# EAGLE schematic Project 2 (EAGLE 6.5.1)
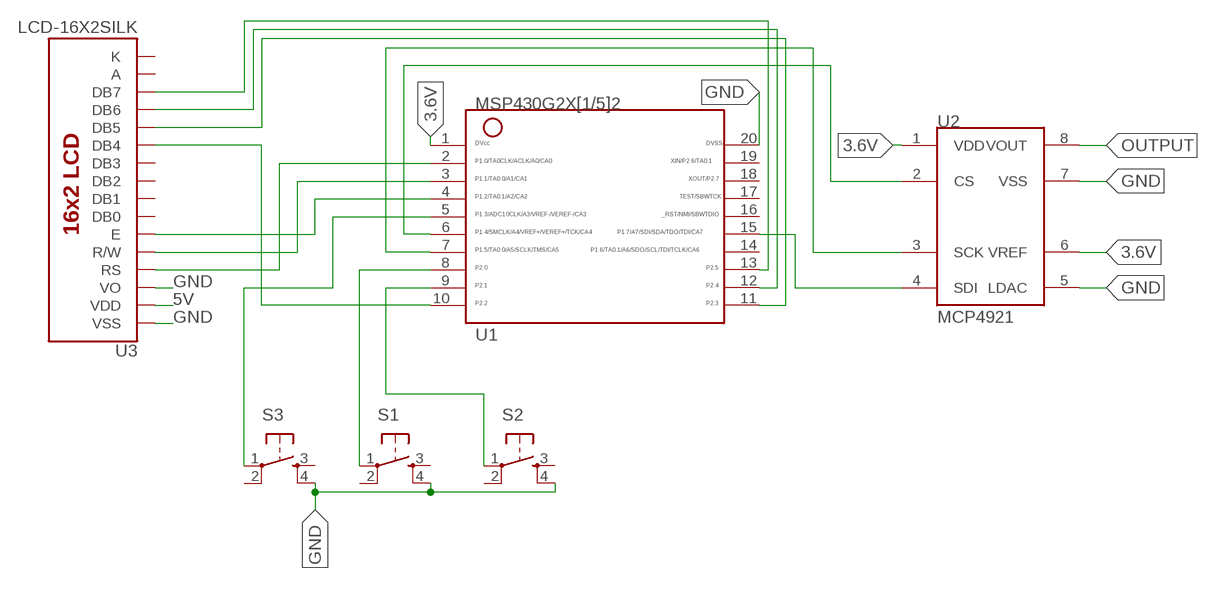
[diagram p0: schematic, sheet 1]

## Parts
S1  TAC_SWITCHPTH  [TACTILE-PTH]
S2  TAC_SWITCHPTH  [TACTILE-PTH]
S3  TAC_SWITCHPTH  [TACTILE-PTH]
U1  G2X[1/5]2---PW20  [PW20]
U2  MCP4921  [DIL8]
U3  LCD-16X2SILK  [LCD-16X2]

## Nets
3.6V: U1.1 U2.1(VDD) U2.6(VREF)
5V: U3.2(VDD)
GND: S1.4 S2.4 S3.4 U1.20 U2.5(LDAC) U2.7(VSS) U3.1(VSS) U3.3(VO)
N$1: U1.2 U3.4(RS)
N$2: U1.3 U3.5(R/W)
N$3: U1.4 U3.6(E)
N$4: S3.1 U1.5
N$5: U1.10 U3.11(DB4)
N$6: U1.6 U2.2(CS)
N$7: U1.7 U2.3(SCK)
N$8: U1.15 U2.4(SDI)
N$9: S1.1 U1.8
N$10: S2.1 U1.9
N$11: U1.11 U3.12(DB5)
N$12: U1.12 U3.13(DB6)
N$13: U1.13 U3.14(DB7)
OUTPUT: U2.8(VOUT)
Unconnected: S1.2 S1.3 S2.2 S2.3 S3.2 S3.3 U1.14 U1.16 U1.17 U1.18 U1.19 U3.7(DB0) U3.8(DB1) U3.9(DB2) U3.10(DB3)

## Power pins joined to a net without a drawn wire
A: U3.15(A)
K: U3.16(K)

## Library data of the parts
S1-S3 = SparkFun-Electromechanical:TAC_SWITCH: Momentary Switch Button commonly used for reset or general input. Spark Fun Electronics SKU : COM-00097 SMT- SWCH-08247
U1 = TI_MSP430_v16:G2X[1/5]2---PW20: MSP430G2X[1/5]2 MSP430G2x52, MSP430G2x12 TSSOP (PW) 20 Pin Package http://focus.ti.com/docs/prod/folders/print/msp430g2452.html
U2 = microchip:MCP4921
U3 = SparkFun-Displays:LCD-16X2: Standard text-only 16x2 parallel input LCD